# EAGLE schematic Schematic (EAGLE 8.6.0)
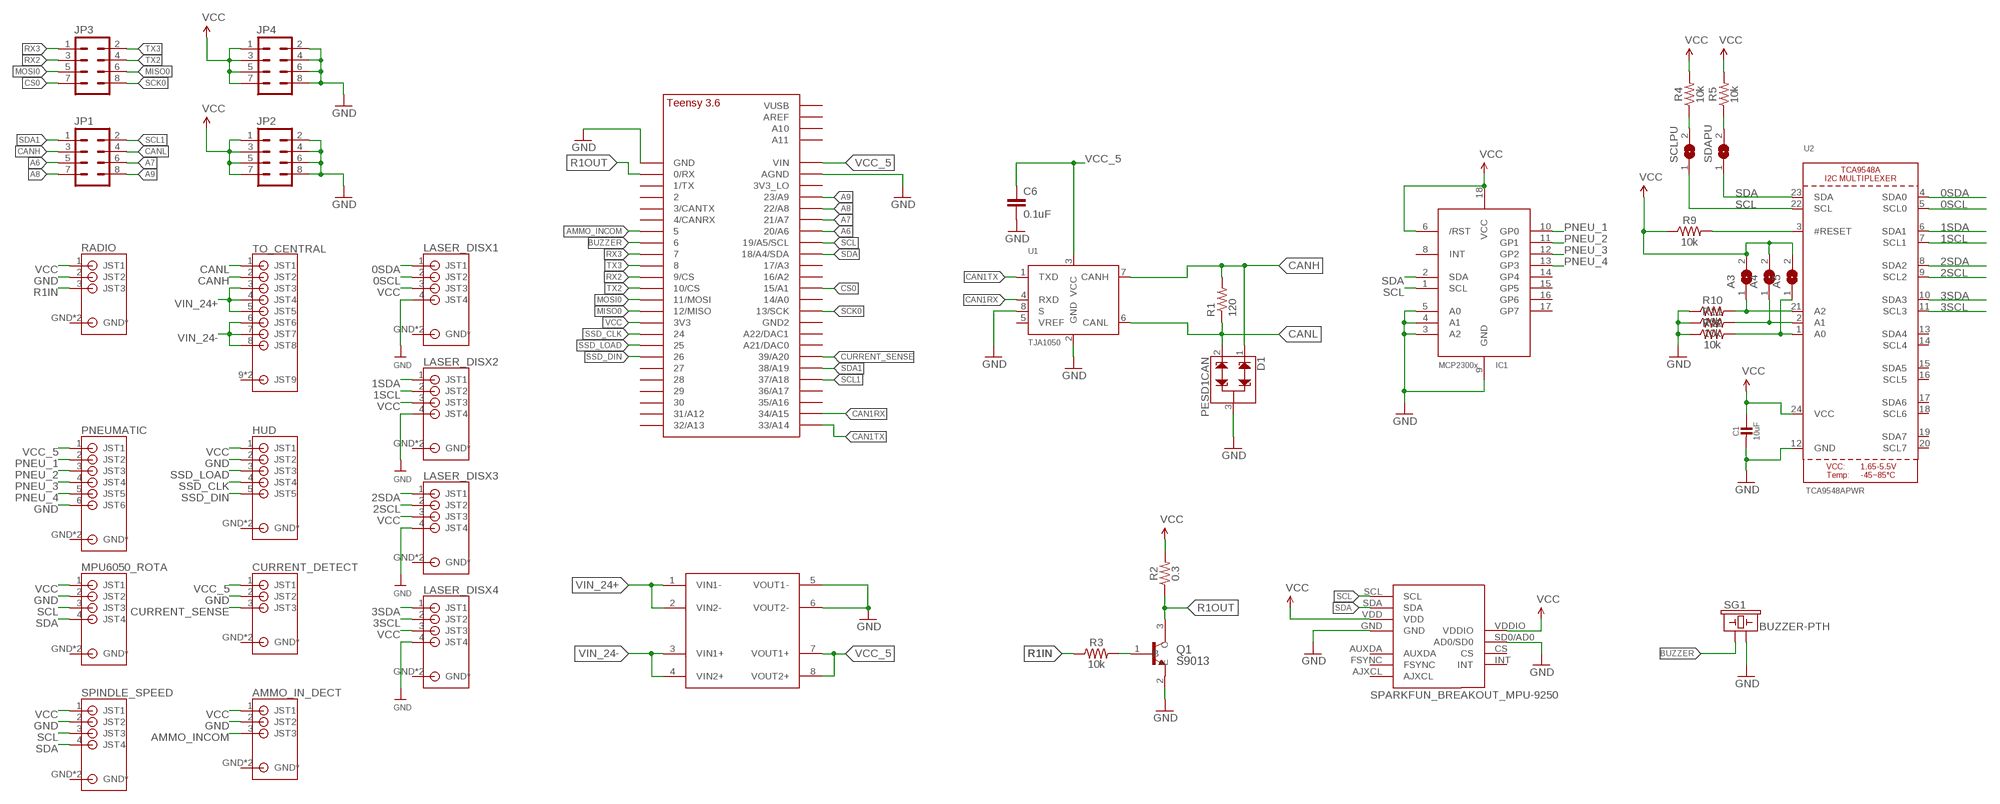
[diagram p0: schematic, sheet 1]

## Parts
A3  SOLDERJUMPER  [SOLDERJUMPER_ARROW_NOPASTE]
A4  SOLDERJUMPER  [SOLDERJUMPER_ARROW_NOPASTE]
A5  SOLDERJUMPER  [SOLDERJUMPER_ARROW_NOPASTE]
AMMO_IN_DECT  S3B-PH-SM4_TB  [S3B-PH-SM4_TB]
C1  10uF  CAP_CERAMIC0805-NOOUTLINE  [0805-NO]
C6  0.1uF  0.1UF-25V(+80/-20%)(0603)  [0603-CAP]
CURRENT_DETECT  S3B-PH-SM4_TB  [S3B-PH-SM4_TB]
D1  PESD1CAN  [SOT23-3]
HUD  S5B-PH-SM4_TB  [S5B-PH-SM4_TB]
IC1  MCP23008/SO  [SO18W]
JP1  M04X2  [2X4]
JP2  M04X2  [2X4]
JP3  M04X2  [2X4]
JP4  M04X2  [2X4]
LASER_DISX1  S4B-PH-SM4_TB  [S4B-PH-SM4_TB]
LASER_DISX2  S4B-PH-SM4_TB  [S4B-PH-SM4_TB]
LASER_DISX3  S4B-PH-SM4_TB  [S4B-PH-SM4_TB]
LASER_DISX4  S4B-PH-SM4_TB  [S4B-PH-SM4_TB]
MPU6050_ROTA  S4B-PH-SM4_TB  [S4B-PH-SM4_TB]
PNEUMATIC  S6B-PH-SM4_TB  [S6B-PH-SM4_TB]
Q1  S9013  [SOT95P240X120-3N]
R1  120  0.22OHM-1/4W-1%(0805)  [0805@1]
R2  0.3  0.3OHM-0805-1/8W-1%  [0805]
R3  10k  10KOHM-0603-1/10W-1%  [0603]
R4  10k  10KOHM-0603-1/10W-1%  [0603]
R5  10k  10KOHM-0603-1/10W-1%  [0603]
R9  10k  10KOHM-0603-1/10W-1%  [0603]
R10  10k  10KOHM-0603-1/10W-1%  [0603]
R11  10k  10KOHM-0603-1/10W-1%  [0603]
R12  10k  10KOHM-0603-1/10W-1%  [0603]
RADIO  S3B-PH-SM4_TB  [S3B-PH-SM4_TB]
SCLPU  SOLDERJUMPERCLOSED  [SOLDERJUMPER_CLOSEDWIRE]
SDAPU  SOLDERJUMPERCLOSED  [SOLDERJUMPER_CLOSEDWIRE]
SG1  BUZZER-PTH  [BUZZER-12MM]
SPINDLE_SPEED  S4B-PH-SM4_TB  [S4B-PH-SM4_TB]
TO_CENTRAL  S8B-PH-SM4_TB  [S8B-PH-SM4_TB]
U1  TJA1050  [SOT96-1]
U2  TCA9548APWR  TCA9548A  [TSSOP24]
U$1  TEENSY_3.5/3.6_BASIC  [TEENSY_3.5/3.6_BASIC]
U$2  MP1584  [MP1584_AMAZON]
U$4  SPARKFUN_BREAKOUT_MPU-9250  [SPARKFUN_BREAKOUT_MPU-9250]

## Nets
0SCL: LASER_DISX1.2(JST2) U2.5(SCL0)
0SDA: LASER_DISX1.1(JST1) U2.4(SDA0)
1SCL: LASER_DISX2.2(JST2) U2.7(SCL1)
1SDA: LASER_DISX2.1(JST1) U2.6(SDA1)
2SCL: LASER_DISX3.2(JST2) U2.9(SCL2)
2SDA: LASER_DISX3.1(JST1) U2.8(SDA2)
3SCL: LASER_DISX4.2(JST2) U2.11(SCL3)
3SDA: LASER_DISX4.1(JST1) U2.10(SDA3)
A0: A5.1 R12.2 U2.1(A0)
A1: A4.1 R11.2 U2.2(A1)
A2: A3.1 R10.2 U2.21(A2)
A6: JP1.5 U$1.20/A6
A7: JP1.6 U$1.21/A7
A8: JP1.7 U$1.22/A8
A9: JP1.8 U$1.23/A9
AMMO_INCOM: AMMO_IN_DECT.3(JST3) U$1.5
BUZZER: SG1.+ U$1.6
CAN1RX: U1.4(RXD) U$1.34/A15
CAN1TX: U1.1(TXD) U$1.33/A14
CANH: D1.1 JP1.3 R1.2 TO_CENTRAL.2(JST2) U1.7(CANH)
CANL: D1.2 JP1.4 R1.1 TO_CENTRAL.1(JST1) U1.6(CANL)
CS0: JP3.7 U$1.15/A1
CURRENT_SENSE: CURRENT_DETECT.3(JST3) U$1.39/A20
GND: AMMO_IN_DECT.2(JST2) C1.2 C6.2 CURRENT_DETECT.2(JST2) D1.3 HUD.2(JST2) IC1.3(A2) IC1.4(A1) IC1.5(A0) IC1.9(GND) JP2.2 JP2.4 JP2.6 JP2.8 JP4.2 JP4.4 JP4.6 JP4.8 LASER_DISX1.4(JST4) LASER_DISX2.4(JST4) LASER_DISX3.4(JST4) LASER_DISX4.4(JST4) MPU6050_ROTA.2(JST2) PNEUMATIC.6(JST6) Q1.2(E) R10.1 R11.1 R12.1 RADIO.2(JST2) SG1.- SPINDLE_SPEED.2(JST2) U1.2(GND) U1.8(S) U2.12(GND) U$1.AGND U$1.GND U$2.5(VOUT1-) U$2.6(VOUT2-) U$4.GND U$4.SD0/AD0(AD0/SD0)
MISO0: JP3.6 U$1.12/MISO
MOSI0: JP3.5 U$1.11/MOSI
N$2: Q1.1(B) R3.2
N$3: R4.1 SCLPU.2
N$4: R5.1 SDAPU.2
N$5: R9.2 U2.3(#RESET)
PNEU_1: IC1.10(GP0) PNEUMATIC.2(JST2)
PNEU_2: IC1.11(GP1) PNEUMATIC.3(JST3)
PNEU_3: IC1.12(GP2) PNEUMATIC.4(JST4)
PNEU_4: IC1.13(GP3) PNEUMATIC.5(JST5)
R1IN: R3.1 RADIO.3(JST3)
R1OUT: Q1.3(C) R2.1 U$1.0/RX
RX2: JP3.3 U$1.9/CS
RX3: JP3.1 U$1.7
SCK0: JP3.8 U$1.13/SCK
SCL: IC1.1(SCL) MPU6050_ROTA.3(JST3) SCLPU.1 SPINDLE_SPEED.3(JST3) U2.22(SCL) U$1.19/A5/SCL U$4.SCL
SCL1: JP1.2 U$1.37/A18
SDA: IC1.2(SDA) MPU6050_ROTA.4(JST4) SDAPU.1 SPINDLE_SPEED.4(JST4) U2.23(SDA) U$1.18/A4/SDA U$4.SDA
SDA1: JP1.1 U$1.38/A19
SSD_CLK: HUD.4(JST4) U$1.24
SSD_DIN: HUD.5(JST5) U$1.26
SSD_LOAD: HUD.3(JST3) U$1.25
TX2: JP3.4 U$1.10/CS
TX3: JP3.2 U$1.8
VCC: A3.2 A4.2 A5.2 AMMO_IN_DECT.1(JST1) C1.1 HUD.1(JST1) IC1.6(/RST) IC1.18(VCC) JP2.1 JP2.3 JP2.5 JP2.7 JP4.1 JP4.3 JP4.5 JP4.7 LASER_DISX1.3(JST3) LASER_DISX2.3(JST3) LASER_DISX3.3(JST3) LASER_DISX4.3(JST3) MPU6050_ROTA.1(JST1) R2.2 R4.2 R5.2 R9.1 RADIO.1(JST1) SPINDLE_SPEED.1(JST1) U2.24(VCC) U$1.3V3 U$4.VDD U$4.VDDIO
VCC_5: C6.1 CURRENT_DETECT.1(JST1) PNEUMATIC.1(JST1) U1.3(VCC) U$1.VIN U$2.7(VOUT1+) U$2.8(VOUT2+)
VIN_24+ [POWER]: TO_CENTRAL.3(JST3) TO_CENTRAL.4(JST4) TO_CENTRAL.5(JST5) U$2.1(VIN1-) U$2.2(VIN2-)
VIN_24- [POWER]: TO_CENTRAL.6(JST6) TO_CENTRAL.7(JST7) TO_CENTRAL.8(JST8) U$2.3(VIN1+) U$2.4(VIN2+)
Unconnected: AMMO_IN_DECT.GND2(GND*) AMMO_IN_DECT.GND(GND*) CURRENT_DETECT.GND2(GND*) CURRENT_DETECT.GND(GND*) HUD.GND2(GND*) HUD.GND(GND*) IC1.8(INT) IC1.14(GP4) IC1.15(GP5) IC1.16(GP6) IC1.17(GP7) LASER_DISX1.GND2(GND*) LASER_DISX1.GND(GND*) LASER_DISX2.GND2(GND*) LASER_DISX2.GND(GND*) LASER_DISX3.GND2(GND*) LASER_DISX3.GND(GND*) LASER_DISX4.GND2(GND*) LASER_DISX4.GND(GND*) MPU6050_ROTA.GND2(GND*) MPU6050_ROTA.GND(GND*) PNEUMATIC.GND2(GND*) PNEUMATIC.GND(GND*) RADIO.GND2(GND*) RADIO.GND(GND*) SPINDLE_SPEED.GND2(GND*) SPINDLE_SPEED.GND(GND*) TO_CENTRAL.9(JST9) TO_CENTRAL.10(JST9) U1.5(VREF) U2.13(SDA4) U2.14(SCL4) U2.15(SDA5) U2.16(SCL5) U2.17(SDA6) U2.18(SCL6) U2.19(SDA7) U2.20(SCL7) U$1.1/TX U$1.2 U$1.3/CANTX U$1.3V3_LO U$1.4/CANRX U$1.14/A0 U$1.16/A2 U$1.17/A3 U$1.21/DAC0(A21/DAC0) U$1.27 U$1.28 U$1.29 U$1.30 U$1.31/A12 U$1.32/A13 U$1.35/A16 U$1.36/A17 U$1.A10 U$1.A11 U$1.A22/DAC1 U$1.AREF U$1.GND2 U$1.VUSB U$4.AJXCL U$4.AUXDA U$4.CS U$4.FSYNC U$4.INT

## Library data of the parts
A3-A5 = microbuilder:SOLDERJUMPER: SMD Solder JUMPER Solder the two pads together to create a connection, or remove the solder to break it. REFLOW - Use this footprint for solder paste and reflow ovens. WAVE - Use this footprint for hand-soldering (larger pads). CLOSED - Has a trace between the two pads to ensure it is closed by default. The trace needs to be cut to disable the jumper, and can be closed again by creating a solder bridge between the two pads.; BOM: EXCLUDE
AMMO_IN_DECT CURRENT_DETECT RADIO = KevinMade:S3B-PH-SM4_TB
C1 = microbuilder:CAP_CERAMIC: Ceramic Capacitors For new designs, use the packages preceded by an '_' character since they are more reliable: The following footprints should be used on most boards: _0402 - Standard footprint for regular board layouts _0603 - Standard footprint for regular board layouts _0805 - Standard footprint for regular board layouts _1206 - Standard footprint for regular board layouts For extremely tight-pitch boards where space is at a premium, the following 'micro-pitch' footprints can be used (smaller pads, no silkscreen outline, etc.): _0402MP - Micro-pitch footprint for very dense/compact boards _0603MP - Micro-pitch footprint for very dense/compact boards _0805MP - Micro-pitch footprint for very dense/compact boards _1206MP - Micro-pitch footprint for very dense/compact boards
C6 = SparkFun-Capacitors:0.1UF-25V(+80/-20%)(0603): CAP-00810 Ceramic Standard decoupling cap; PROD_ID: CAP-00810
D1 = SparkFun-DiscreteSemi:PESD1CAN: CAN bus ESD protection diode PESD1CAN is used to protect two CAN bus lines from ESD. Link to datasheet <http://www.nxp.com/documents/data_sheet/PESD1CAN-U.pdf> SparkFun Products: SparkFun CAN-BUS Shield <https://www.sparkfun.com/products/13262>; PROD_ID: DIO-12501
HUD = KevinMade:S5B-PH-SM4_TB
IC1 = adafruit:MCP23008: MCP23008 Inexpensive i2c i/o expander - 8 general purpose i/o pins with optional pullups
JP1-JP4 = SparkFun-Connectors:M04X2: .1" header, two rows of four.
LASER_DISX1-LASER_DISX4 MPU6050_ROTA SPINDLE_SPEED = KevinMade:S4B-PH-SM4_TB
PNEUMATIC = KevinMade:S6B-PH-SM4_TB
Q1 = S9013:S9013: SMD Transistors NPN 25V-500mA; AVAILABILITY: Unavailable; DESCRIPTION: SMD Transistors NPN 25V-500mA; MF: JCET; MP: S9013; PACKAGE: SOT-23-3 JCET; PRICE: None
R1 = SparkFun-Resistors:0.22OHM-1/4W-1%(0805): RES-09883; PROD_ID: RES-09883; VALUE: 0.22
R2 = SparkFun-Resistors:0.3OHM: 0.3Ω resistor A resistor is a passive two-terminal electrical component that implements electrical resistance as a circuit element. Resistors act to reduce current flow, and, at the same time, act to lower voltage levels within circuits. - Wikipedia; PROD_ID: RES-11622
R3-R5 R9-R12 = SparkFun-Resistors:10KOHM: 10kΩ resistor A resistor is a passive two-terminal electrical component that implements electrical resistance as a circuit element. Resistors act to reduce current flow, and, at the same time, act to lower voltage levels within circuits. - Wikipedia; PROD_ID: RES-00824
SCLPU SDAPU = microbuilder:SOLDERJUMPER: SMD Solder JUMPER Solder the two pads together to create a connection, or remove the solder to break it. REFLOW - Use this footprint for solder paste and reflow ovens. WAVE - Use this footprint for hand-soldering (larger pads). CLOSED - Has a trace between the two pads to ensure it is closed by default. The trace needs to be cut to disable the jumper, and can be closed again by creating a solder bridge between the two pads.
SG1 = SparkFun-Electromechanical:BUZZER: Buzzer Small round buzzers that operate around the audible 2kHz range. You can use these as speakers to create simple music or user interfaces. Variant Overview: PTH - Mini Speaker - PC Mount 12mm 2.048kHz <https://www.sparkfun.com/products/7950> PTH_KIT - Mini Speaker - PC Mount 12mm 2.048kHz <https://www.sparkfun.com/products/7950> KIT simplifies soldering by adding stop mask to one side of the pads. PTH_NO_SILK - Mini Speaker - PC Mount 12mm 2.048kHz <https://www.sparkfun.com/products/7950> No silkscreen indicator of buzzer outline. PTH_KIT_NO_SILK - Mini Speaker - PC Mount 12mm 2.048kHz <https://www.sparkfun.com/products/7950> KIT package w/o silkscreen SMD - Buzzer Audio Magnetic (CCV-084B16) SMD buzzer used on, e.g. the LilyPad Buzzer <https://www.sparkfun.com/products/8463> and RFID USB Reader <https://www.sparkfun.com/products/9963>. SMD_KIT - Buzzer Audio Magnetic (CCV-084B16) SMD Buzzer with elongated pins to make soldering easier. Used on the SparkFun Simon Says - Surface Mount Soldering Kit <https://www.sparkfun.com/products/10935>.; PROD_ID: COMP-08253; SF_SKU: COM-07950
TO_CENTRAL = KevinMade:S8B-PH-SM4_TB
U1 = TJA1050:TJA1050: High speed CAN transceiver The TJA1050 is the interface between the Controller Area Network (CAN) protocol controller and the physical bus. The device provides differential transmit capability to the bus and differential receive capability to the CAN controller. The TJA1050 is the third Philips high-speed CAN transceiver after the PCA82C250 and the PCA82C251. The most important differences are: Much lower electromagnetic emission due to optimal matching of the output signals CANH and CANL Improved behaviour in case of an unpowered node No standby mode. This makes the TJA1050 eminently suitable for use in nodes that are in a power-down situation in partially powered networks. AAL Eindhoven MK; AVAILABILITY: Unavailable; MF: NXP Semiconductors; MP: TJA1050; PACKAGE: None; PRICE: 0.32 USD
U2 = microbuilder:TCA9548A: TCA9548A I2C Multiplexer
U$1 = Teensy356:TEENSY_3.5/3.6_BASIC
U$2 = MP1584BUCK:MP1584
U$4 = KevinMade:SPARKFUN_BREAKOUT_MPU-9250

## Net classes
0 default: width 0.305 mm, drill 0.305 mm, clearance 0.254 mm
1 POWER: width 0.508 mm, drill 0.508 mm, clearance 0.254 mm